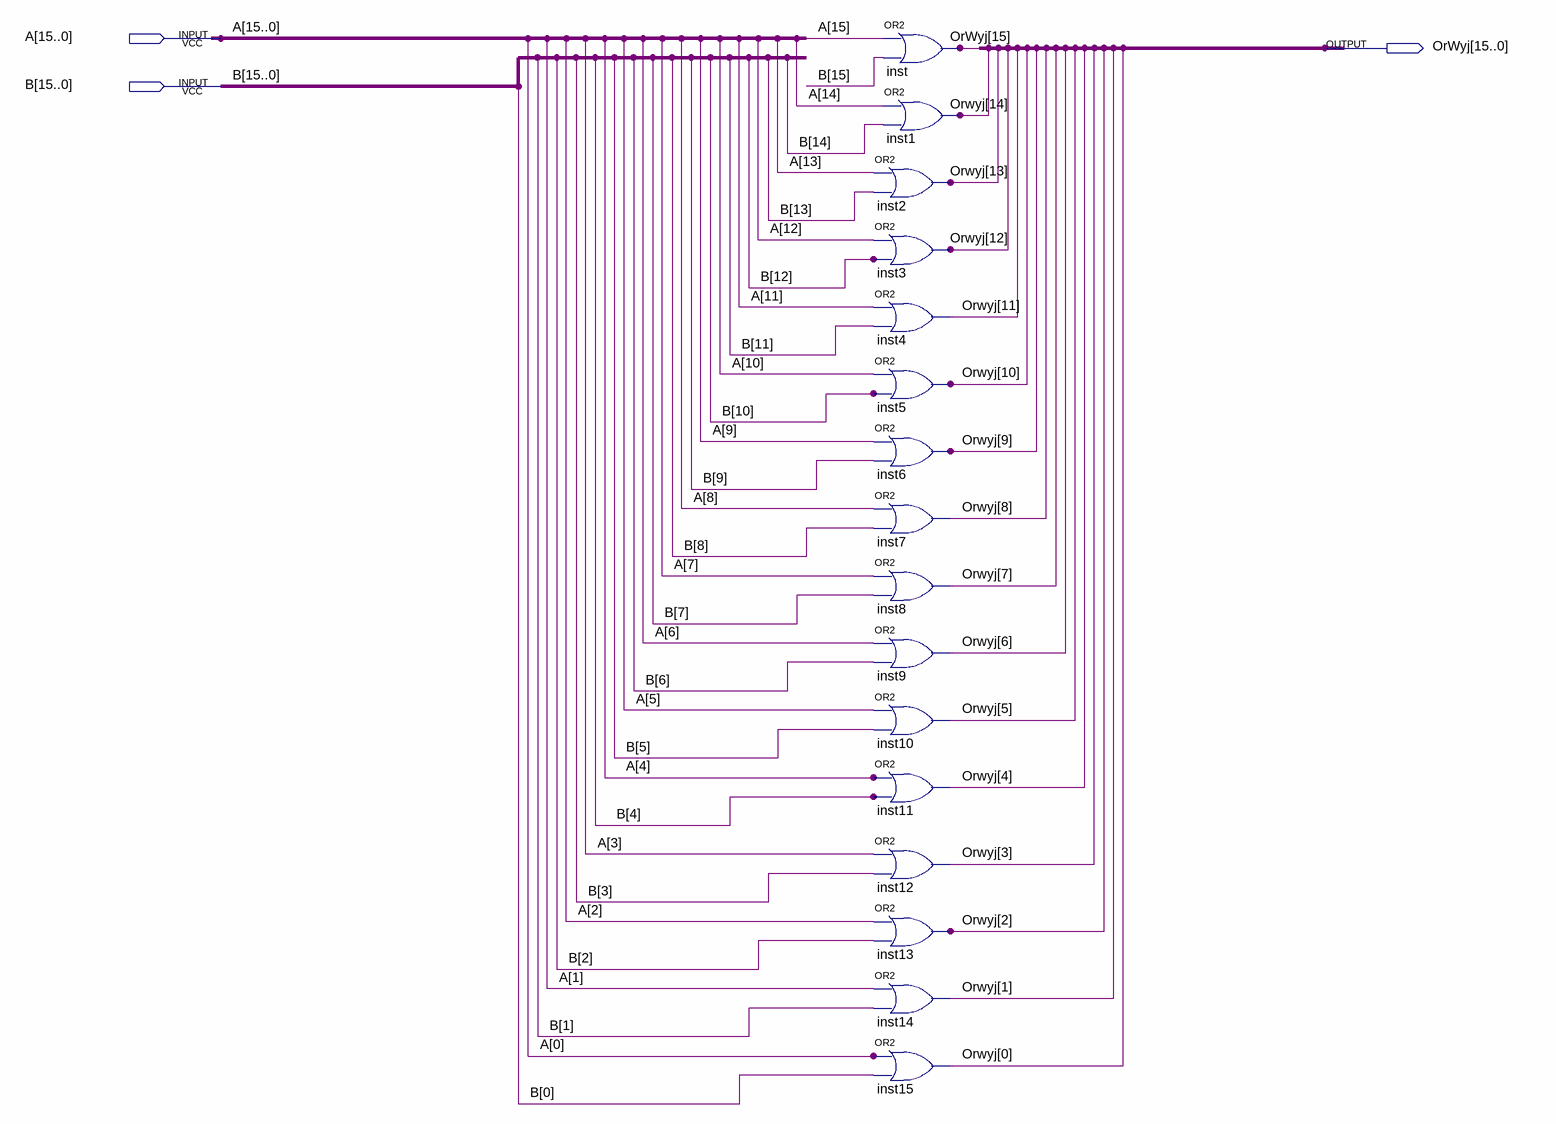
[diagram p0: schematic sheet]
// Quartus schematic orvector.bdf as structural Verilog: 16 symbols, 3 pins
module orvector (
  input  [15:0] A,
  input  [15:0] B,
  output [15:0] OrWyj
);

  or inst (OrWyj[15], A[15], B[15]);
  or inst1 (OrWyj[14], A[14], B[14]);
  or inst2 (OrWyj[13], A[13], B[13]);
  or inst3 (OrWyj[12], A[12], B[12]);
  or inst4 (OrWyj[11], A[11], B[11]);
  or inst5 (OrWyj[10], A[10], B[10]);
  or inst6 (OrWyj[9], A[9], B[9]);
  or inst7 (OrWyj[8], A[8], B[8]);
  or inst8 (OrWyj[7], A[7], B[7]);
  or inst9 (OrWyj[6], A[6], B[6]);
  or inst10 (OrWyj[5], A[5], B[5]);
  or inst11 (OrWyj[4], A[4], B[4]);
  or inst12 (OrWyj[3], A[3], B[3]);
  or inst13 (OrWyj[2], A[2], B[2]);
  or inst14 (OrWyj[1], A[1], B[1]);
  or inst15 (OrWyj[0], A[0], B[0]);
endmodule
